# Altium schematic sheet 23005_6.SchDoc: Classic Computer IO Platform
size A3; Date: 06/11/2018; CompanyName: Heber Ltd; Organization: Heber Limited; DocumentNumber: 56-23005; Revision: 3; SheetNumber: 6; SheetTotal: 6
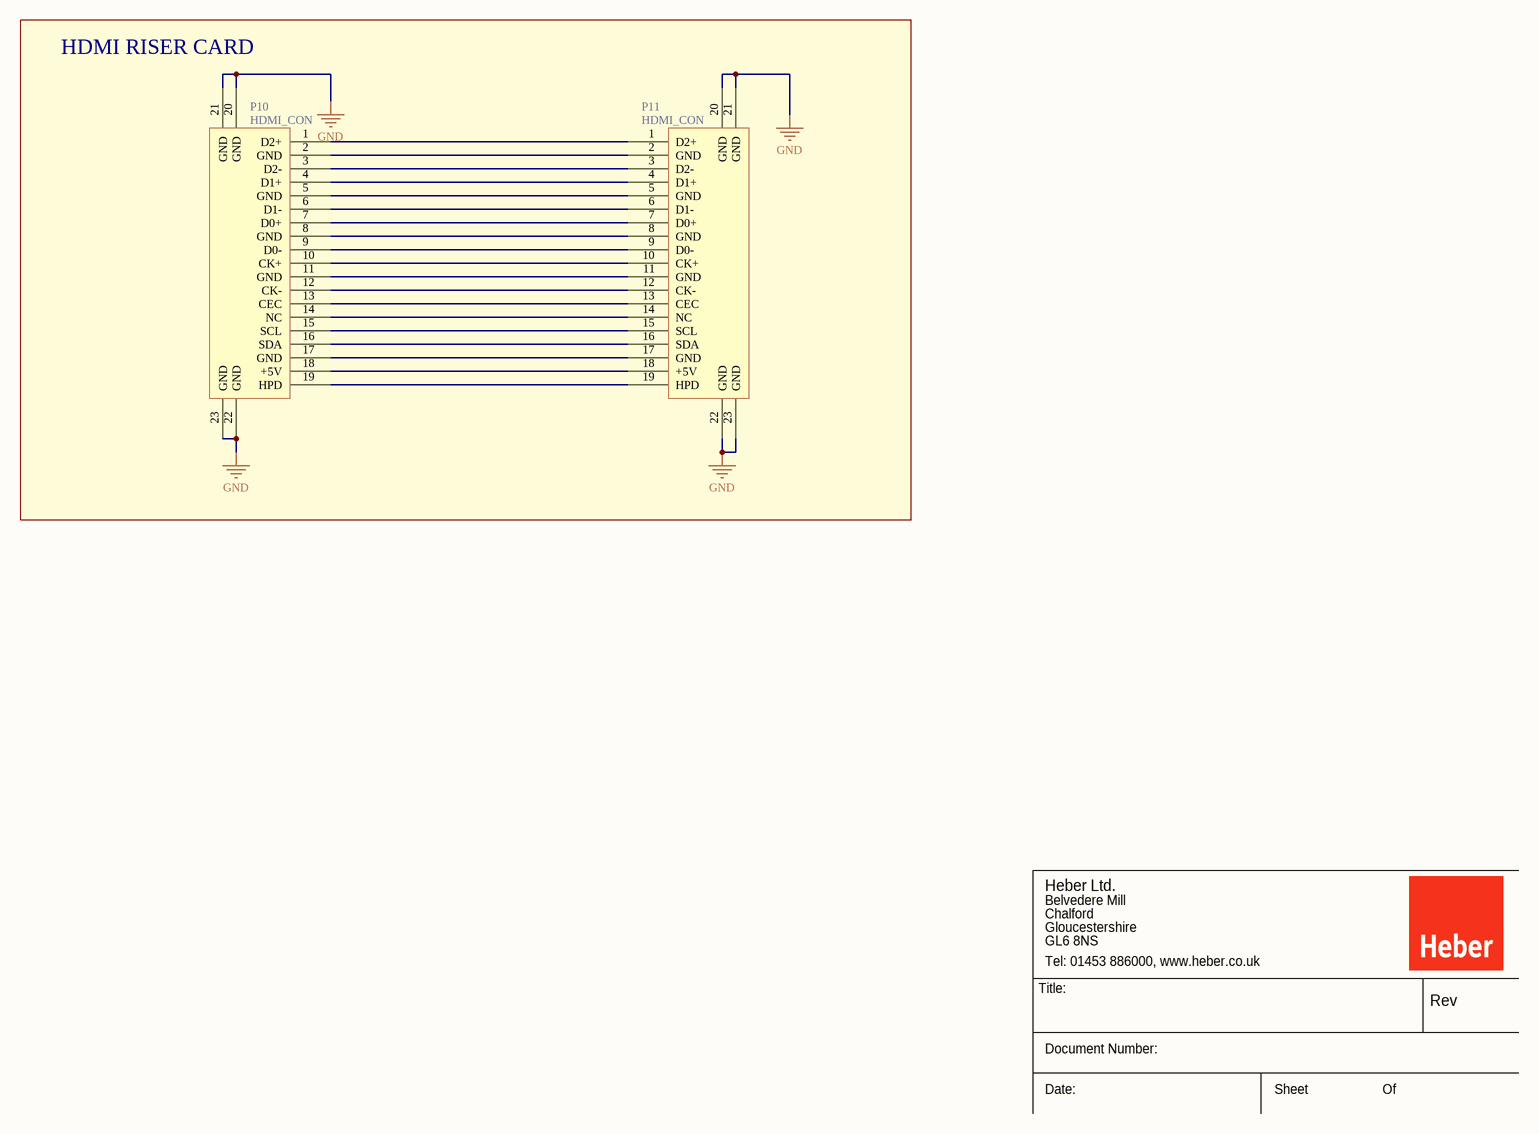
[diagram p0: 23005_6.SchDoc]

## Parts
P10  HDMI_CON  [HDMI_VERT_PTH]
P11  HDMI_CON  [HDMI_VERT_PTH]

## Blocks framed on the sheet
HDMI RISER CARD: P10 P11

## Nets
GND: P10.20(GND) P10.21(GND) P10.22(GND) P10.23(GND) P11.20(GND) P11.21(GND) P11.22(GND) P11.23(GND)
NetP10_1: P10.1(D2+) P11.1(D2+)
NetP10_2: P10.2(GND) P11.2(GND)
NetP10_3: P10.3(D2-) P11.3(D2-)
NetP10_4: P10.4(D1+) P11.4(D1+)
NetP10_5: P10.5(GND) P11.5(GND)
NetP10_6: P10.6(D1-) P11.6(D1-)
NetP10_7: P10.7(D0+) P11.7(D0+)
NetP10_8: P10.8(GND) P11.8(GND)
NetP10_9: P10.9(D0-) P11.9(D0-)
NetP10_10: P10.10(CK+) P11.10(CK+)
NetP10_11: P10.11(GND) P11.11(GND)
NetP10_12: P10.12(CK-) P11.12(CK-)
NetP10_13: P10.13(CEC) P11.13(CEC)
NetP10_14: P10.14(NC) P11.14(NC)
NetP10_15: P10.15(SCL) P11.15(SCL)
NetP10_16: P10.16(SDA) P11.16(SDA)
NetP10_17: P10.17(GND) P11.17(GND)
NetP10_18: P10.18(+5V) P11.18(+5V)
NetP10_19: P10.19(HPD) P11.19(HPD)

## Notes on the sheet
- Heber Ltd.
- Belvedere Mill
- Chalford
- GL6 8NS
- Gloucestershire
- Tel: 01453 886000, www.heber.co.uk
- Title:
- Rev
- Document Number:
- Date:
- Sheet
- Of